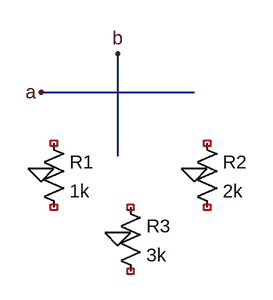
[diagram p0: schematic crossing_wires.asc]
crossing_wires.asc, the LTspice schematic file:
Version 4
SHEET 1 880 680
WIRE 96 96 288 96
WIRE 192 48 192 176
SYMBOL res 96 144 R0
SYMATTR InstName R1
SYMATTR Value 1k
SYMBOL res 288 144 R0
SYMATTR InstName R2
SYMATTR Value 2k
FLAG 96 192 0
FLAG 288 192 0
FLAG 96 96 a
FLAG 192 48 b
SYMBOL res 192 224 R0
SYMATTR InstName R3
SYMATTR Value 3k
FLAG 192 272 0

The netlist it stands for:
* crossing_wires.asc
R1 NC_01 NC_02 1k
R2 NC_03 NC_04 2k
R3 NC_05 NC_06 3k
.backanno
.end